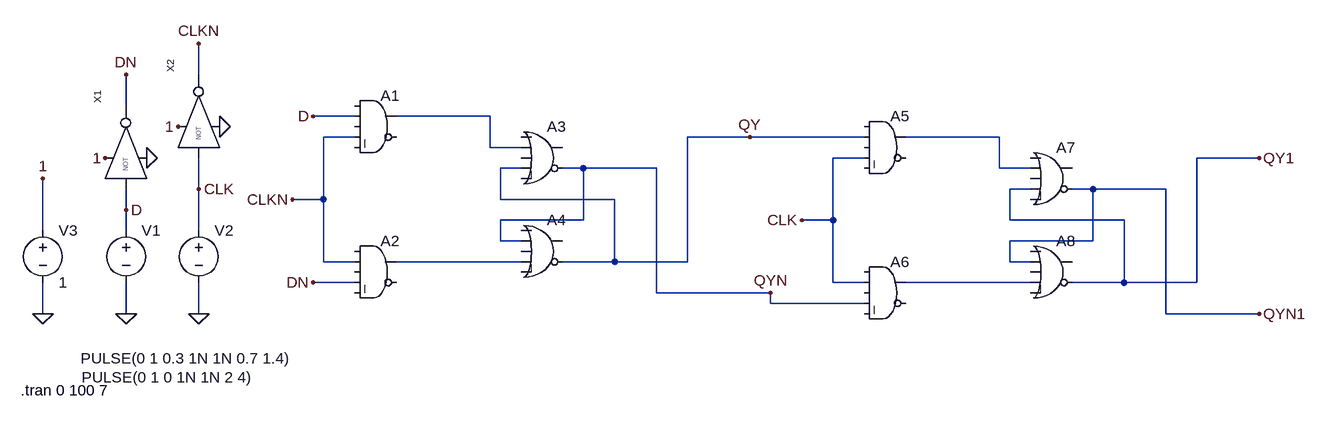
[diagram p0: schematic Draft49.asc]
Draft49.asc, the LTspice schematic file:
Version 4
SHEET 1 880 680
WIRE -864 -96 -864 -144
WIRE -976 -48 -976 -96
WIRE -624 -32 -688 -32
WIRE -416 -32 -560 -32
WIRE -624 0 -672 0
WIRE -16 0 -112 0
WIRE 160 0 -16 0
WIRE 368 0 224 0
WIRE -416 16 -416 -32
WIRE -368 16 -416 16
WIRE 160 32 112 32
WIRE 768 32 672 32
WIRE -368 48 -400 48
WIRE -272 48 -304 48
WIRE -160 48 -272 48
WIRE 368 48 368 0
WIRE 416 48 368 48
WIRE -864 80 -864 32
WIRE 416 80 384 80
WIRE 512 80 480 80
WIRE 624 80 512 80
WIRE -672 96 -672 0
WIRE -672 96 -720 96
WIRE -400 96 -400 48
WIRE -224 96 -400 96
WIRE -976 112 -976 80
WIRE -272 128 -272 48
WIRE -272 128 -400 128
WIRE 112 128 112 32
WIRE 112 128 64 128
WIRE 384 128 384 80
WIRE 560 128 384 128
WIRE -1104 144 -1104 64
WIRE -976 144 -976 112
WIRE -864 144 -864 80
WIRE -400 160 -400 128
WIRE -368 160 -400 160
WIRE 512 160 512 80
WIRE 512 160 384 160
WIRE -672 192 -672 96
WIRE -624 192 -672 192
WIRE -368 192 -560 192
WIRE -224 192 -224 96
WIRE -224 192 -304 192
WIRE -112 192 -112 0
WIRE -112 192 -224 192
WIRE 384 192 384 160
WIRE 416 192 384 192
WIRE -624 224 -688 224
WIRE 112 224 112 128
WIRE 160 224 112 224
WIRE 416 224 224 224
WIRE 560 224 560 128
WIRE 560 224 480 224
WIRE 672 224 672 32
WIRE 672 224 560 224
WIRE -160 240 -160 48
WIRE 16 240 -160 240
WIRE 16 256 16 240
WIRE 160 256 16 256
WIRE -1104 272 -1104 224
WIRE -976 272 -976 224
WIRE -864 272 -864 224
WIRE 624 272 624 80
WIRE 768 272 624 272
FLAG -720 96 CLKN
FLAG -688 -32 D
FLAG -16 0 QY
FLAG 64 128 CLK
FLAG 768 272 QYN1
FLAG 768 32 QY1
FLAG 16 240 QYN
FLAG -688 224 DN
FLAG -1008 32 1
FLAG -1104 64 1
FLAG -944 32 0
FLAG -1104 272 0
FLAG -976 272 0
FLAG -864 272 0
FLAG -976 112 D
FLAG -976 -96 DN
FLAG -864 80 CLK
FLAG -896 -16 1
FLAG -832 -16 0
FLAG -864 -144 CLKN
SYMBOL Digital\\and -592 -80 R0
SYMATTR InstName A1
SYMBOL Digital\\and -592 144 R0
SYMATTR InstName A2
SYMBOL Digital\\or -336 -32 R0
SYMATTR InstName A3
SYMBOL Digital\\or -336 112 R0
SYMATTR InstName A4
SYMBOL Digital\\and 192 -48 R0
SYMATTR InstName A5
SYMBOL Digital\\and 192 176 R0
SYMATTR InstName A6
SYMBOL Digital\\or 448 0 R0
SYMATTR InstName A7
SYMBOL Digital\\or 448 144 R0
SYMATTR InstName A8
SYMBOL voltage -976 128 R0
WINDOW 3 -70 213 Left 2
WINDOW 123 0 0 Left 0
WINDOW 39 0 0 Left 0
SYMATTR InstName V1
SYMATTR Value PULSE(0 1 0.3 1N 1N 0.7 1.4)
SYMBOL voltage -864 128 R0
WINDOW 3 -180 242 Left 2
WINDOW 123 0 0 Left 0
WINDOW 39 0 0 Left 0
SYMATTR InstName V2
SYMATTR Value PULSE(0 1 0 1N 1N 2 4)
SYMBOL NOT4 -960 16 R270
SYMATTR InstName X1
SYMBOL voltage -1104 128 R0
WINDOW 123 0 0 Left 0
WINDOW 39 0 0 Left 0
SYMATTR InstName V3
SYMATTR Value 1
SYMBOL NOT4 -848 -32 R270
SYMATTR InstName X2
TEXT -1138 390 Left 2 !.tran 0 100 7

The netlist it stands for:
* Draft49.asc
A1 0 D 0 CLKN 0 0 N001 0 AND
A2 0 CLKN 0 DN 0 0 N003 0 AND
A3 0 N001 0 QY 0 QYN 0 0 OR
A4 0 QYN 0 N003 0 QY 0 0 OR
A5 0 QY 0 CLK 0 0 N002 0 AND
A6 0 CLK 0 QYN 0 0 N004 0 AND
A7 0 N002 0 QY1 0 QYN1 0 0 OR
A8 0 QYN1 0 N004 0 QY1 0 0 OR
V1 D 0 PULSE(0 1 0.3 1N 1N 0.7 1.4)
V2 CLK 0 PULSE(0 1 0 1N 1N 2 4)
XX1 D 1 0 DN NOT4  ; pins A VH VL OUT
V3 1 0 1
XX2 CLK 1 0 CLKN NOT4  ; pins A VH VL OUT
.tran 0 100 7
.backanno
.end

* Results of the author's LTspice run, read from the files saved beside the schematic
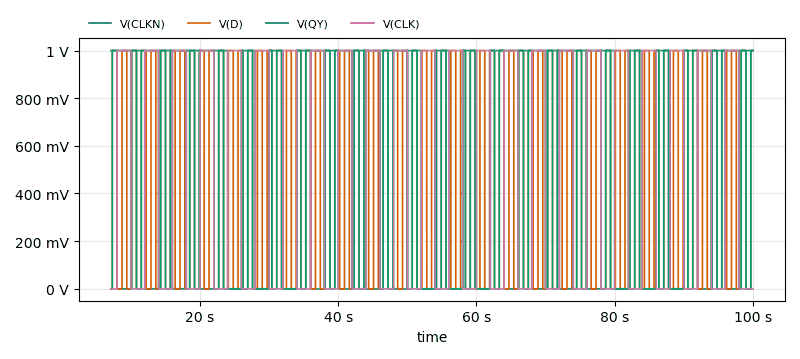
[diagram p1: Transient Analysis of Draft49.asc, plotted from the saved traces]
* Transient Analysis, 1 run:
*   V(CLKN): min -888.7 nV, max 1.001 V, average 504.9 mV, rms 710.6 mV, last 1 V
*   V(D): min 0 V, max 1 V, average 500.5 mV, rms 707.4 mV, last 1 V
*   V(QY): min 0 V, max 1 V, average 558.6 mV, rms 747.4 mV, last 1 V
*   V(CLK): min 0 V, max 1 V, average 495.1 mV, rms 703.6 mV, last 0 V